# Altium schematic sheet Doorbellv1.3.SchDoc
size A4; SheetNumber: 3; SheetTotal: 3
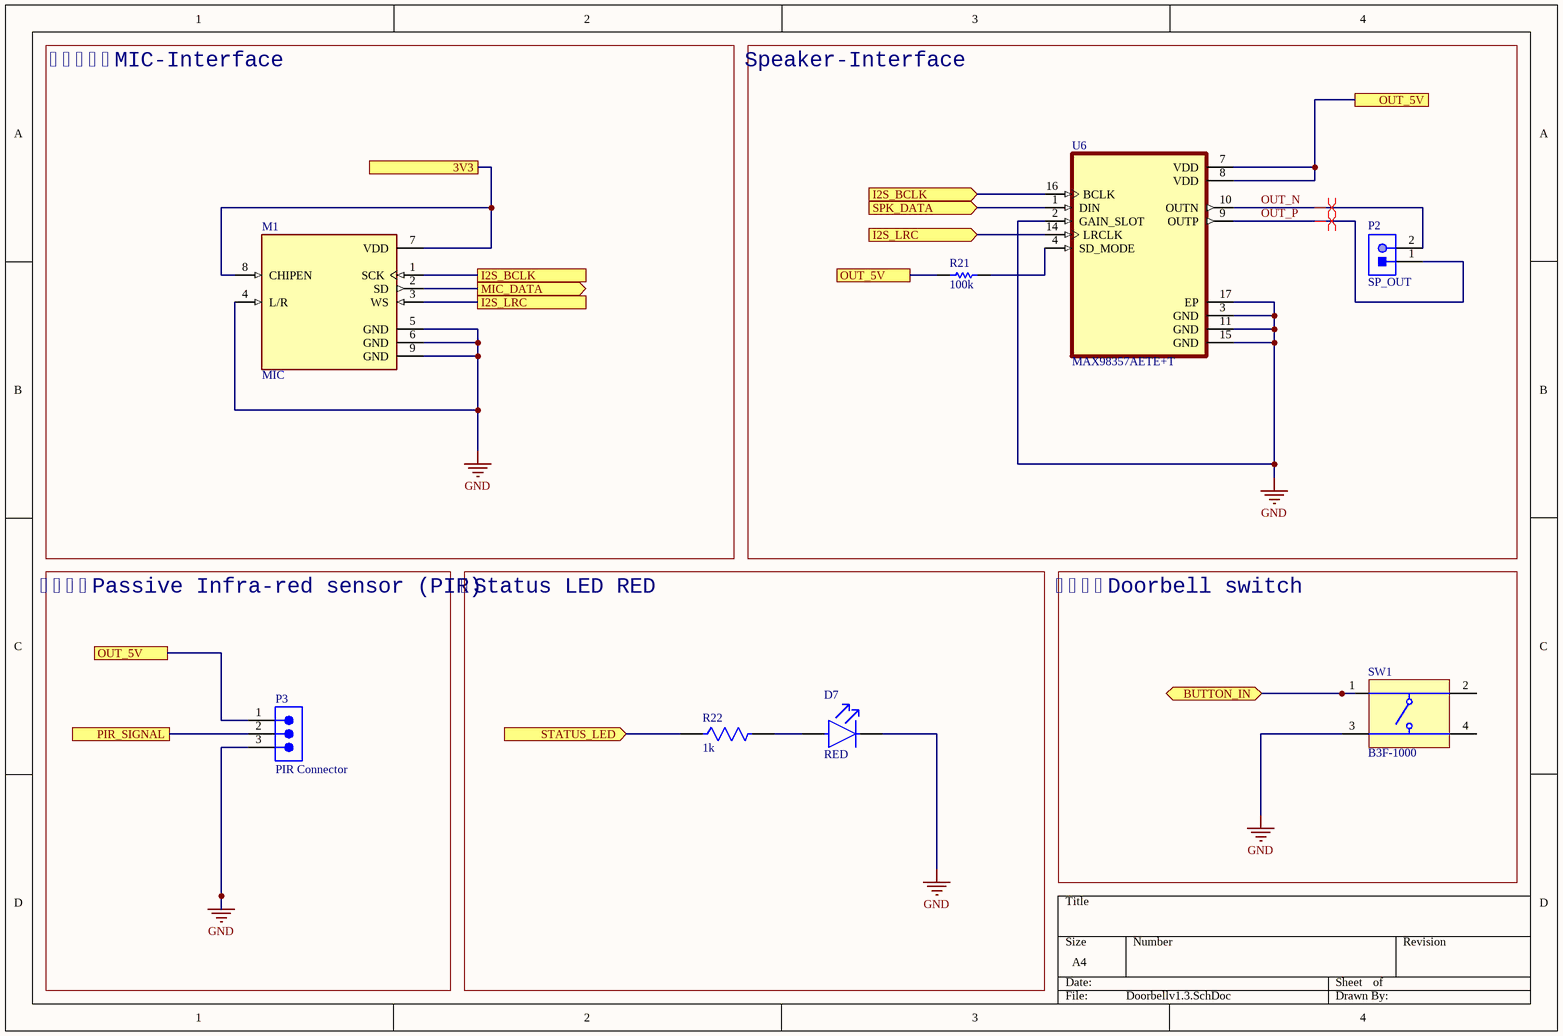
[diagram p0: Doorbellv1.3.SchDoc]

## Parts
D7  RED  [FP-LS_R976-MFG]
M1  MIC  [MIC_INMP441ACEZ-R7]
P2  SP_OUT  [JST-S2B-PH-K-S_V]
P3  PIR Connector  [61300311121]
R21  100k  [RESC0603(1608)_N]
R22  1k  [FP-MCU0805-IPC_A]
SW1  B3F-1000  [OMRON-B3F-1000-4_V]
U6  MAX98357AETE+T  [QFN50P300X300X80-17N]

## Blocks framed on the sheet
MIC-Interface: M1
Speaker-Interface: P2 R21 U6
Passive Infra-red sensor (PIR): P3
Status LED RED: D7 R22
Doorbell switch: SW1

## Ports
3V3 (see Doorbellv1.1[3C], Doorbellv1.2[2A]), BUTTON_IN (bidir, see Doorbellv1.2[2B]), I2S_BCLK (in, see Doorbellv1.2[1B], Doorbellv1.3[2B]), I2S_BCLK (see Doorbellv1.2[1B], Doorbellv1.3[3A]), I2S_LRC (in, see Doorbellv1.2[1B], Doorbellv1.3[2B]), I2S_LRC (see Doorbellv1.2[1B], Doorbellv1.3[3A]), MIC_DATA (out, see Doorbellv1.2[1B]), OUT_5V (see Doorbellv1.1[3C], Doorbellv1.1[4B], Doorbellv1.2[4B], Doorbellv1.3[1C], Doorbellv1.3[3B]), OUT_5V (see Doorbellv1.1[3C], Doorbellv1.1[4B], Doorbellv1.2[4B], Doorbellv1.3[1C], Doorbellv1.3[4A]), OUT_5V (see Doorbellv1.1[3C], Doorbellv1.1[4B], Doorbellv1.2[4B], Doorbellv1.3[3B], Doorbellv1.3[4A]), PIR_SIGNAL (see Doorbellv1.2[2C]), SPK_DATA (in, see Doorbellv1.2[1B]), STATUS_LED (in, see Doorbellv1.2[2C])

## Nets
GND: D7.1(C) M1.4(L/R) M1.5(GND) M1.6(GND) M1.9(GND) P3.3 SW1.3 U6.2(GAIN_SLOT) U6.3(GND) U6.11(GND) U6.15(GND) U6.17(EP)
3V3: M1.7(VDD) M1.8(CHIPEN) ; port 3V3
BUTTON_IN: SW1.1 ; port BUTTON_IN
I2S_BCLK: M1.1(SCK) U6.16(BCLK) ; port I2S_BCLK
I2S_LRC: M1.3(WS) U6.14(LRCLK) ; port I2S_LRC
MIC_DATA: M1.2(SD) ; port MIC_DATA
OUT_5V: P3.1 R21.2 U6.7(VDD) U6.8(VDD) ; port OUT_5V
OUT_N: P2.2 U6.10(OUTN)
OUT_P: P2.1 U6.9(OUTP)
PIR_SIGNAL: P3.2 ; port PIR_SIGNAL
SPK_DATA: U6.1(DIN) ; port SPK_DATA
STATUS_LED: R22.1 ; port STATUS_LED
NetD7_2: D7.2(A) R22.2
NetR21_1: R21.1 U6.4(SD_MODE)

Not connected (* = marked no-connect by the designer): SW1 2 4

## Layout directives
differential pair: OUT_N, OUT_P

## Library data of the parts
D7 = CMP-62016-000037-1: LED RED DIFFUSED 0805 SMD; Lens Size: 1.25mm; Number of LEDs: 1; Luminous Intensity: 180mcd; Dominant Wavelength: 633nm; Lens Style: Flat; Reverse Voltage: 12V; Lens Color: White; Forward Voltage: 2.5V; Forward Current: 25mA; Power Dissipation: 65W; Luminous Flux: 0.47lm; Test Current: 20mA; Viewing Angle: 160°; Length: 2mm; Number of Pins: 2; Lens Transparency: Diffused; Min Operating Temperature: -30°C; Case Code (Metric): 2012; Depth: 1.35mm; Color: Red; Illumination Color: Red; Max Operating Temperature: 85°C; Mount: Surface Mount; Case/Package: 0805; Height: 0.9mm; Package Quantity: 16000; Number of Elements: 1; Radiation Hardening: No; Case Code (Imperial): 0805; Packaging: Tape and Reel; Width: 1.25mm
M1 = INMP441ACEZ-R7: 60 Hz ~ 15 kHz Digital, I2S Microphone MEMS (Silicon) 1.62 V ~ 3.63 V Omnidirectional (-26dB Â±3dB @ 94dB SPL) Solder Pads; MF: TDK InvenSense; SnapEDA_Link: https://www.snapeda.com/parts/INMP441ACEZ-R7/TDK/view-part/?ref=snap; Package: LGA-9 TDK InvenSense; Value: *; MP: INMP441ACEZ-R7; Check_prices: https://www.snapeda.com/parts/INMP441ACEZ-R7/TDK/view-part/?ref=eda
P2 = CMP-1755-00004-1: Male Header, Pitch 2 mm, 1 x 2 Position, Height 4.8 mm, Tail Length 3.4 mm, -25 to 85 degC, RoHS, Bulk; Case\Package: Radial; Tolerance: 20%; Capacitance: 10 uF; Voltage Rating (DC): 50 V; Packaging: Bulk; ComponentLink1URL: http://www.jst-mfg.com/product/pdf/eng/ePH.pdf; Radiation Hardening: No; Height: 11 mm; Package Quantity: 200; PackageDescription: Male Header, Pitch 2 mm, 1 x 2 Position, Height 4.8 mm, Tail Length 3.4 mm; PackageReference: S2B-PH-K-S; Diameter: 5 mm; Pins: 2; Mount: Through Hole; Max Operating Temperature: 85 degC; Min Operating Temperature: -40 degC; ComponentLink1Description: Datasheet; DatasheetVersion: Dec-12; Length: 11 mm; Lead Pitch: 2 mm; REACH SVHC: No SVHC; Voltage Rating: 50 V; RoHSCompliant: true
P3 = CMP-1502-01062-4: THT Vertical Pin Header WR-PHD, Pitch 2.54 mm, Single Row, 3 pins; Connector Type: Male Pin; Number of Contacts: 3; Operating Supply Voltage: 250V; Current Rating: 3A; Pitch: 2.54mm; Contact Resistance: 20mΩ; Gender: Male; Height: 8.94mm; Color: Black; Min Operating Temperature: -40°C; Max Operating Temperature: 105°C; Mount: Through Hole; Termination: Solder; Number of Rows: 1; Packaging: Bulk; Number of Pins: 3; Lead Pitch: 2.54mm; RoHS: Compliant; Contact Plating: Gold; Number of Positions: 3; Lead Free: Lead Free; Voltage Rating: 250V; Contact Mating Length: 5.9944mm; Orientation: Vertical; Contact Material: Gold
R21 = CMP-1012-00736-1: 100K 0.1W 1% 0603 (1608 Metric)  SMD; Value: 100000.00 Ohm; Case-Metric: 1608; Case-EIA: 0603; Power: 0.1 W; Tolerance: 1 %; Technology: SMT
R22 = CMP-02407-000288-1: RES 1.05K OHM 0.5% 1/5W 0805; Tolerance: 0.1%; Resistance: 1kR; Power Rating: 200mW; Voltage Rating: 150V; Max Operating Temperature: 155°C; Width: 1.25mm; Min Operating Temperature: -55°C; Case Code (Metric): 2012; Packaging: Tape and Reel; Case Code (Imperial): 0805; Length: 2mm; Height: 0.52mm; Case/Package: 0805; Weight: 0.000162oz; Composition: Thin Film
SW1 = CMP-1677-00002-1: Tactile Switch, SPST-NO, 0.05 A, 5 to 24 V, -25 to 70 degC, 4-Pin THD, RoHS, Bulk; Shielding: Shielded; Gender: Female; Capacitance: -45 f; Voltage Rating: 150 V; Current Rating: 1.5 A; Radiation Hardening: No; Contact Plating: Gold; Height: 14.99 mm; Min Operating Temperature: -40 degC; Packaging: Tray; ComponentLink2Description: Datasheet; ComponentLink1URL: http://www.omron.com/; Lead Pitch: 1.27 mm; RoHSCompliant: true; Pins: 8; PackageReference: B3F-1000; Width: 25.4 mm; Contact Material: Brass; ComponentLink2URL: http://www.omron.com/ecb/products/pdf/en-b3f.pdf; PackageDescription: 4-Pin Through Hole Device, Body 6 x 6 mm; DatasheetVersion: Jan-15; ComponentLink1Description: Manufacturer URL; Package Quantity: 1080; Mount: Through Hole; Length: 18.34 mm; Max Operating Temperature: 70 degC
U6 = MAX98357AETE+T: Tiny, Low-Cost, PCM Class D Amplifier with Class AB Performance; MF: Analog Devices; SnapEDA_Link: https://www.snapeda.com/parts/MAX98357AETE+T/Analog+Devices/view-part/?ref=snap; Package: TQFN-16 Maxim; Value: *; MP: MAX98357AETE+T; Check_prices: https://www.snapeda.com/parts/MAX98357AETE+T/Analog+Devices/view-part/?ref=eda